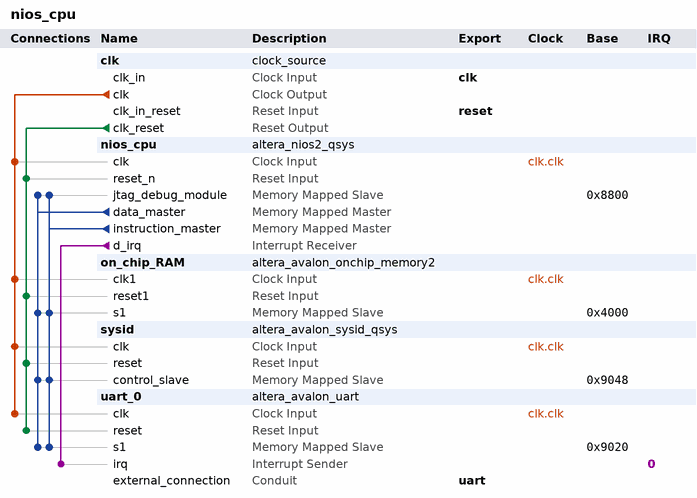
[diagram p0: system contents]
# Platform Designer (Qsys) system nios_cpu
# Parameters at their usual value, and those the tool derives, are not listed.
package require -exact qsys 11.0
create_system nios_cpu
set_project_property DEVICE_FAMILY CYCLONEII

add_instance clk clock_source 11.0
set_instance_parameter_value clk clockFrequency 50000000

add_instance nios_cpu altera_nios2_qsys 11.0
set_instance_parameter_value nios_cpu manuallyAssignCpuID false
set_instance_parameter_value nios_cpu resetSlave on_chip_RAM.s1
set_instance_parameter_value nios_cpu exceptionSlave on_chip_RAM.s1
set_instance_parameter_value nios_cpu breakSlave nios_cpu.jtag_debug_module
set_instance_parameter_value nios_cpu impl Tiny
set_instance_parameter_value nios_cpu icache_size 4096

add_instance on_chip_RAM altera_avalon_onchip_memory2 11.0
set_instance_parameter_value on_chip_RAM dataWidth 32
set_instance_parameter_value on_chip_RAM dualPort false
set_instance_parameter_value on_chip_RAM initMemContent true
set_instance_parameter_value on_chip_RAM initializationFileName on_chip_RAM
set_instance_parameter_value on_chip_RAM memorySize 16384

add_instance sysid altera_avalon_sysid_qsys 11.0
set_instance_parameter_value sysid id 1802

add_instance uart_0 altera_avalon_uart 11.0
set_instance_parameter_value uart_0 baud 115200
set_instance_parameter_value uart_0 dataBits 8
set_instance_parameter_value uart_0 fixedBaud true
set_instance_parameter_value uart_0 parity NONE
set_instance_parameter_value uart_0 stopBits 1

# connections
add_connection clk.clk nios_cpu.clk clock
add_connection clk.clk on_chip_RAM.clk1 clock
add_connection clk.clk sysid.clk clock
add_connection clk.clk uart_0.clk clock
add_connection clk.clk_reset nios_cpu.reset_n reset
add_connection clk.clk_reset on_chip_RAM.reset1 reset
add_connection clk.clk_reset sysid.reset reset
add_connection clk.clk_reset uart_0.reset reset
add_connection nios_cpu.data_master nios_cpu.jtag_debug_module avalon
set_connection_parameter_value nios_cpu.data_master/nios_cpu.jtag_debug_module baseAddress 0x8800
add_connection nios_cpu.data_master on_chip_RAM.s1 avalon
set_connection_parameter_value nios_cpu.data_master/on_chip_RAM.s1 baseAddress 0x4000
add_connection nios_cpu.data_master sysid.control_slave avalon
set_connection_parameter_value nios_cpu.data_master/sysid.control_slave baseAddress 0x9048
add_connection nios_cpu.data_master uart_0.s1 avalon
set_connection_parameter_value nios_cpu.data_master/uart_0.s1 baseAddress 0x9020
add_connection nios_cpu.instruction_master nios_cpu.jtag_debug_module avalon
set_connection_parameter_value nios_cpu.instruction_master/nios_cpu.jtag_debug_module baseAddress 0x8800
add_connection nios_cpu.instruction_master on_chip_RAM.s1 avalon
set_connection_parameter_value nios_cpu.instruction_master/on_chip_RAM.s1 baseAddress 0x4000
add_connection nios_cpu.instruction_master sysid.control_slave avalon
set_connection_parameter_value nios_cpu.instruction_master/sysid.control_slave baseAddress 0x9048
add_connection nios_cpu.instruction_master uart_0.s1 avalon
set_connection_parameter_value nios_cpu.instruction_master/uart_0.s1 baseAddress 0x9020
add_connection nios_cpu.d_irq uart_0.irq interrupt
set_connection_parameter_value nios_cpu.d_irq/uart_0.irq irqNumber 0

# exported interfaces
add_interface clk clock sink
set_interface_property clk EXPORT_OF clk.clk_in
add_interface reset reset sink
set_interface_property reset EXPORT_OF clk.clk_in_reset
add_interface uart conduit end
set_interface_property uart EXPORT_OF uart_0.external_connection

save_system nios_cpu.qsys
